# Altium schematic sheet Project_Vega_Sensors_Schematic.SchDoc: Principal Node_Sensor Schematic
size A; Date: 10/08/2024; Author: Prudhvi Kondapalli; CompanyName: CU Boulder; Engineer: Prudhvi Kondapalli; DocumentNumber: 1; Revision: 1; SheetNumber: 3; SheetTotal: 5
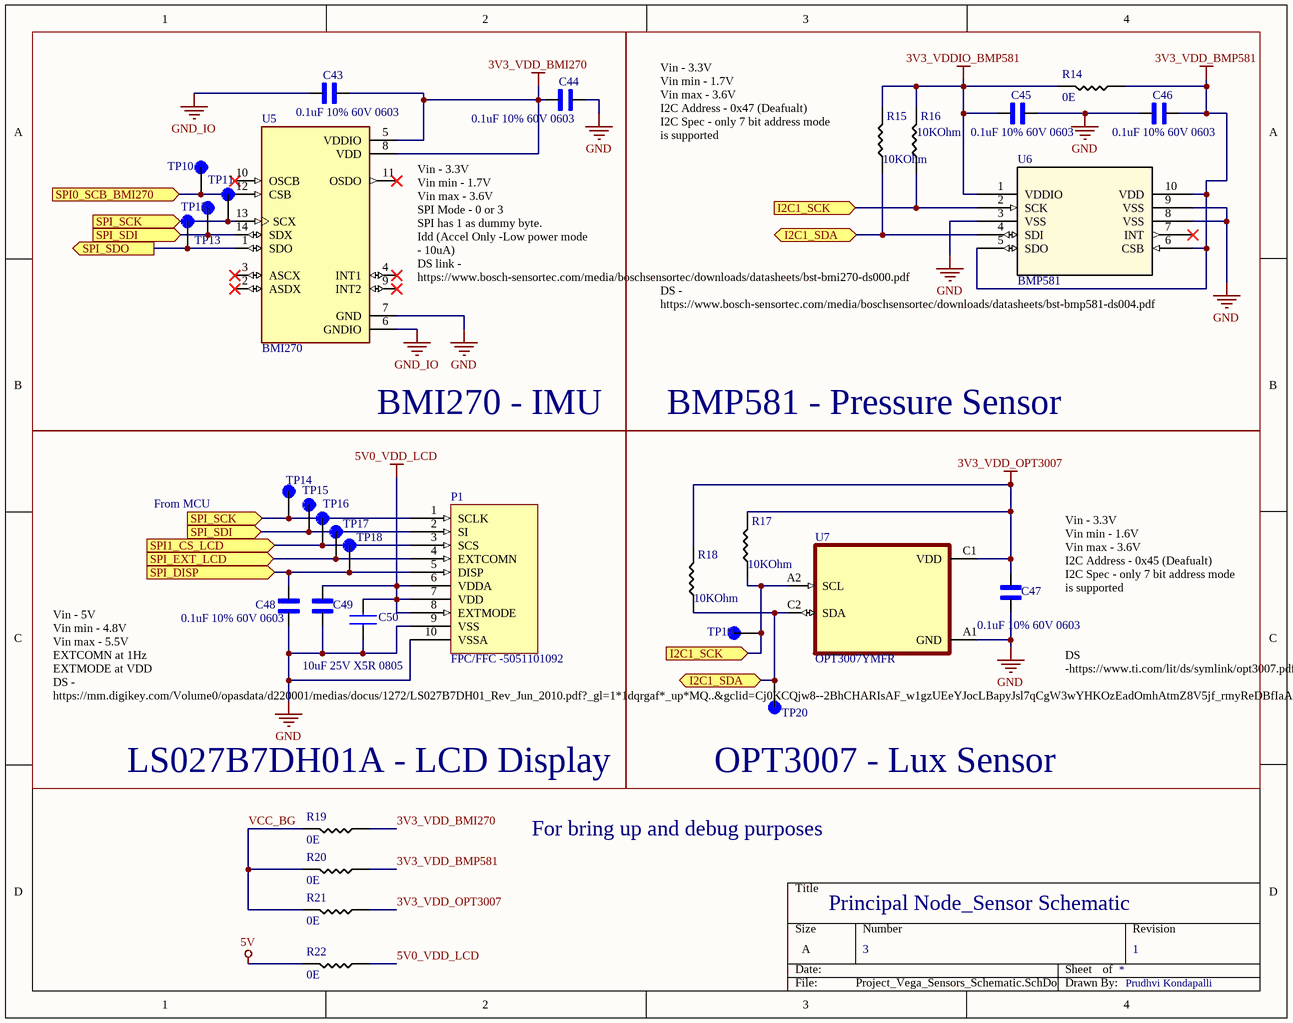
[diagram p0: Project_Vega_Sensors_Schematic.SchDoc]

## Parts
C43  0.1uF 10% 60V 0603  [CAPC1608X90]
C44  0.1uF 10% 60V 0603  [CAPC1608X90]
C45  0.1uF 10% 60V 0603  [CAPC1608X90]
C46  0.1uF 10% 60V 0603  [CAPC1608X90]
C47  0.1uF 10% 60V 0603  [CAPC1608X90]
C48  0.1uF 10% 60V 0603  [CAPC1608X90]
C49  0.1uF 10% 60V 0603  [CAPC1608X90]  (value not drawn)
C50  10uF 25V X5R 0805  [CAP_0805_2mmX1.25mm]
P1  FPC/FFC -5051101092  [CON_5051101092_MOL]
R14  value 0E  [1206_Passive_Resitor]  (hidden comment: 10k)
R15  value 10KOhm  [1206_Passive_Resitor]  (hidden comment: 10k)
R16  value 10KOhm  [1206_Passive_Resitor]  (hidden comment: 10k)
R17  value 10KOhm  [1206_Passive_Resitor]  (hidden comment: 10k)
R18  value 10KOhm  [1206_Passive_Resitor]  (hidden comment: 10k)
R19  value 0E  [1206_Passive_Resitor]  (hidden comment: 10k)
R20  value 0E  [1206_Passive_Resitor]  (hidden comment: 10k)
R21  value 0E  [1206_Passive_Resitor]  (hidden comment: 10k)
R22  value 0E  [1206_Passive_Resitor]  (hidden comment: 10k)
TP10  Test_point  [TP]  (value not drawn)
TP11  Test_point  [TP]  (value not drawn)
TP12  Test_point  [TP]  (value not drawn)
TP13  Test_point  [TP]  (value not drawn)
TP14  Test_point  [TP]  (value not drawn)
TP15  Test_point  [TP]  (value not drawn)
TP16  Test_point  [TP]  (value not drawn)
TP17  Test_point  [TP]  (value not drawn)
TP18  Test_point  [TP]  (value not drawn)
TP19  Test_point  [TP]  (value not drawn)
TP20  Test_point  [TP]  (value not drawn)
U5  BMI270  [XDCR_BMI270]
U6  BMP581  [QFN10_BMP581_BOS-M]
U7  OPT3007YMFR  [BGA6N60X35P2X3_85X94X22N]

## Blocks framed on the sheet
BMI270 - IMU: C43 C44 TP10-TP13 U5
BMP581 - Pressure Sensor: C45 C46 R14-R16 U6

## Ports
I2C1_SCK (in, see Principal[1C], Project_Vega_Sensors_Schematic[3A]), I2C1_SCK (in, see Principal[1C], Project_Vega_Sensors_Schematic[3C]), I2C1_SDA (bidir, see Principal[1C], Project_Vega_Sensors_Schematic[3A]), I2C1_SDA (bidir, see Principal[1C], Project_Vega_Sensors_Schematic[3C]), SPI0_SCB_BMI270 (in, see Principal[2D]), SPI1_CS_LCD (in, see Principal[2D]), SPI_DISP (in, see Principal[1C]), SPI_EXT_LCD (in, see Principal[1C]), SPI_SCK (in, see Principal[1B], Project_Vega_Sensors_Schematic[1A]), SPI_SCK (in, see Principal[1B], Project_Vega_Sensors_Schematic[1C]), SPI_SDI (in, see Principal[1B], Project_Vega_Sensors_Schematic[1A]), SPI_SDI (in, see Principal[1B], Project_Vega_Sensors_Schematic[1C]), SPI_SDO (out, see Principal[1B])

## Nets
3V3_VDD_BMI270: C43.2 C44.1 R19.1 U5.5(VDDIO) U5.8(VDD)
3V3_VDD_BMP581: C46.2 R14.1 R20.1 U6.5(SDO) U6.6(CSB) U6.10(VDD)
3V3_VDD_OPT3007: C47.2 R17.2 R18.2 R21.1 U7.C1(VDD)
3V3_VDDIO_BMP581: C45.1 R14.2 R15.2 R16.2 U6.1(VDDIO)
5V: R22.2
5V0_VDD_LCD: C49.2 C50.1 P1.6(VDDA) P1.7(VDD) P1.8(EXTMODE) R22.1
GND: C44.2 C45.2 C46.1 C47.1 C48.1 C49.1 C50.2 P1.9(VSS) P1.10(VSSA) U5.7(GND) U6.3(VSS) U6.8(VSS) U6.9(VSS) U7.A1(GND)
GND_IO: C43.1 U5.6(GNDIO)
I2C1_SCK: R16.1 R17.1 TP19.TP U6.2(SCK) U7.A2(SCL) ; port I2C1_SCK
I2C1_SDA: R15.1 R18.1 TP20.TP U6.4(SDI) U7.C2(SDA) ; port I2C1_SDA
SPI0_SCB_BMI270: TP10.TP U5.12(CSB) ; port SPI0_SCB_BMI270
SPI1_CS_LCD: P1.3(SCS) TP16.TP ; port SPI1_CS_LCD
SPI_DISP: C48.2 P1.5(DISP) TP18.TP ; port SPI_DISP
SPI_EXT_LCD: P1.4(EXTCOMN) TP17.TP ; port SPI_EXT_LCD
SPI_SCK: P1.1(SCLK) TP11.TP TP14.TP U5.13(SCX) ; port SPI_SCK
SPI_SDI: P1.2(SI) TP12.TP TP15.TP U5.14(SDX) ; port SPI_SDI
SPI_SDO: TP13.TP U5.1(SDO) ; port SPI_SDO
VCC_BG: R19.2 R20.2 R21.2

Not connected (* = marked no-connect by the designer): U5 2(ASDX)* 3(ASCX)* 4(INT1)* 9(INT2)* 10(OSCB)* 11(OSDO)*; U6 7(INT)*

## Notes on the sheet
- (near R15) Vin - 3.3V
  Vin min - 1.7V
  Vin max - 3.6V
  I2C Address - 0x47 (Deafualt)
  I2C Spec - only 7 bit address mode is supported
- Vin - 3.3V
  Vin min - 1.7V
  Vin max - 3.6V
  SPI Mode - 0 or 3
  SPI has 1 as dummy byte.
  Idd (Accel Only -Low power mode - 10uA)
  DS link - https://www.bosch-sensortec.com/media/boschsensortec/downloads/datasheets/bst-bmi270-ds000.pdf
- DS - https://www.bosch-sensortec.com/media/boschsensortec/downloads/datasheets/bst-bmp581-ds004.pdf
- From MCU
- Vin - 3.3V
  Vin min - 1.6V
  Vin max - 3.6V
  I2C Address - 0x45 (Deafualt)
  I2C Spec - only 7 bit address mode is supported
- DS -https://www.ti.com/lit/ds/symlink/opt3007.pdf?HQS=dis-dk-null-digikeymode-dsf-pf-null-wwe&ts=1728281957104&ref_url=https%253A%252F%252Fwww.ti.com%252Fgeneral%252Fdocs%252Fsuppproductinfo.tsp%253FdistId%253D10%2526gotoUrl%253Dhttps%253A%252F%252Fwww.ti.com%252Flit%252Fgpn%252Fopt3007
- Vin - 5V
  Vin min - 4.8V
  Vin max - 5.5V
  EXTCOMN at 1Hz
  EXTMODE at VDD
  DS - https://mm.digikey.com/Volume0/opasdata/d220001/medias/docus/1272/LS027B7DH01_Rev_Jun_2010.pdf?_gl=1*1dqrgaf*_up*MQ..&gclid=Cj0KCQjw8--2BhCHARIsAF_w1gzUEeYJocLBapyJsl7qCgW3wYHKOzEadOmhAtmZ8V5jf_rmyReDBfIaAkmEEALw_wcB
- (near R19) LS027B7DH01A - LCD Display
- (near TP20) OPT3007 - Lux Sensor
- For bring up and debug purposes

## Library data of the parts
C43-C49 = CC0603KRX7R9BB104: 0.1 ÂµF Â±10% 50V Ceramic Capacitor X7R 0603 (1608 Metric); MF: Yageo; SnapEDA_Link: https://www.snapeda.com/parts/CC0603KRX7R9BB104/Yageo/view-part/?ref=snap; Package: 0603 Yageo; Value: *; MP: CC0603KRX7R9BB104; Check_prices: https://www.snapeda.com/parts/CC0603KRX7R9BB104/Yageo/view-part/?ref=eda
C50 = GRM21BR61E106KA73K: Multilayer Ceramic Capacitor, 10 uF, 25 V, +/- 10%, X5R, 0805 [2012 Metric]; Manufacturer: Murata; Supplier: Digikey; Supplier Part Number: 490-16824-1-ND; Manufacturer Part Number: GRM21BR61E106KA73K; RoHS: Yes; Category: Ceramic Capacitors; Stock: 274241; Pricing: 1=0.21, 10=0.133, 50=0.0838, 100=0.0671, 500=0.04848, 1000=0.04288, 2500=0.04102, 5000=0.03729, 10000=0.03542, 20000=0.03356, 30000=0.03169, 50000=0.02983, 100000=0.02517, 250000=0.0233 (USD); Mounting Technology: Surface Mount; Case/Package: 0805; Weight: 0.000335oz; Case Code (Imperial): 0805; Case Code (Metric): 2012; Material: Ceramic; Min Operating Temperature: -55°C; Max Operating Temperature: 85°C; Packaging: Tape and Reel; Value: 10uF; Voltage Rating: 25V; Tolerance: 10%; Package Quantity: 10000; Dielectric: X5R; Voltage Rating (DC): 25V; Series: GRM; Length: 0.079inch; Width: 0.049inch; Height: 1.4mm; Thickness: 0.055inch; RoHS Compliant: Yes; ComponentLink1URL: http://www.mouser.com/ds/2/281/c02e-2905.pdf?src-supplier=Mouser; ComponentLink1Description: http://www.mouser.com/ds/2/281/c02e-2905.pdf?src-supplier=Mouser; ComponentLink2URL: http://search.murata.co.jp/Ceramy/image/img/A01X/G101/ENG/GRM21BR61E106KA73-01.pdf?src-supplier=Digikey; ComponentLink2Description: http://search.murata.co.jp/Ceramy/image/img/A01X/G101/ENG/GRM21BR61E106KA73-01.pdf?src-supplier=Digikey; ComponentLink3URL: https://search.murata.co.jp/Ceramy/image/img/A01X/G101/ENG/GRM21BR61E106KA73-01.pdf?src-supplier=Digikey; ComponentLink3Description: https://search.murata.co.jp/Ceramy/image/img/A01X/G101/ENG/GRM21BR61E106KA73-01.pdf?src-supplier=Digikey; ComponentLink4URL: https://datasheet.octopart.com/GRM21BR61E106KA73K-Murata-datasheet-149523495.pdf?src-supplier=Newark; ComponentLink4Description: https://datasheet.octopart.com/GRM21BR61E106KA73K-Murata-datasheet-149523495.pdf?src-supplier=Newark; ComponentLink5URL: https://datasheet.octopart.com/GRM21BR61E106KA73K-Murata-datasheet-99353849.pdf?src-supplier=Future+Electronics; ComponentLink5Description: https://datasheet.octopart.com/GRM21BR61E106KA73K-Murata-datasheet-99353849.pdf?src-supplier=Future+Electronics; ComponentLink6URL: https://datasheet.octopart.com/GRM21BR61E106KA73K-Murata-datasheet-165579666.pdf?src-supplier=TME; ComponentLink6Description: https://datasheet.octopart.com/GRM21BR61E106KA73K-Murata-datasheet-165579666.pdf?src-supplier=TME
P1 = 5051101092: 10 Position FFC, FPC Connector Contacts, Bottom 0.020" (0.50mm) Surface Mount, Right Angle
R14-R22 = R_10KOhm_1206: 10 kOhms ±5% 0.25W, 1/4W Chip Resistor 1206 (3216 Metric) Automotive AEC-Q200 Thick Film; MFR Part #: RMCF1206FT10K0; Digikey Link: https://www.digikey.com/en/products/detail/stackpole-electronics-inc/RMCF1206FT10K0/1759669; LCSC Part#: C17902; Type: Basic
TP10-TP20 = Test_point: SMT Test Point- Mininature-1000 pc Reels; MP: 5019; MF: Keystone Electronics; Value: *; Availability: In Stock; Purchase-URL: https://pricing.snapeda.com/search/part/5019/?ref=eda; Package: None; Price: None
U5 = BMI270: Accelerometer, Gyroscope, 6 Axis Sensor IÂ²C, SPI Output; MF: Bosch Sensortec; Digi-Key_Part_Number: 828-1091-2-ND; Check_prices: https://www.snapeda.com/parts/BMI270/Bosch+Sensortec/view-part/?ref=eda; MP: BMI270; Package: LGA-14 Bosch Sensortec; SnapEDA_Link: https://www.snapeda.com/parts/BMI270/Bosch+Sensortec/view-part/?ref=snap; Value: *; Purchase-URL: https://pricing.snapeda.com/search/part/BMI270/?ref=eda
U6 = BMP581: No Description Available; Mfr_Name: Bosch Sensortec; RefDes: RefDes; Type: Type
U7 = OPT3007YMFR: Ultra-thin ambient light sensor (ALS) with fixed I2C address 6-PICOSTAR -40 to 85; MF: Texas Instruments; Value: *; MP: OPT3007YMFR; Package: PICOSTAR-6 Texas Instruments; Check_prices: https://www.snapeda.com/parts/OPT3007YMFR/Texas+Instruments/view-part/?ref=eda; Price: None; Purchase-URL: https://pricing.snapeda.com/search/part/OPT3007YMFR/?ref=eda; SnapEDA_Link: https://www.snapeda.com/parts/OPT3007YMFR/Texas+Instruments/view-part/?ref=snap; Availability: In Stock